# EAGLE design p8x-2016-propplug (EAGLE 7.7.0)
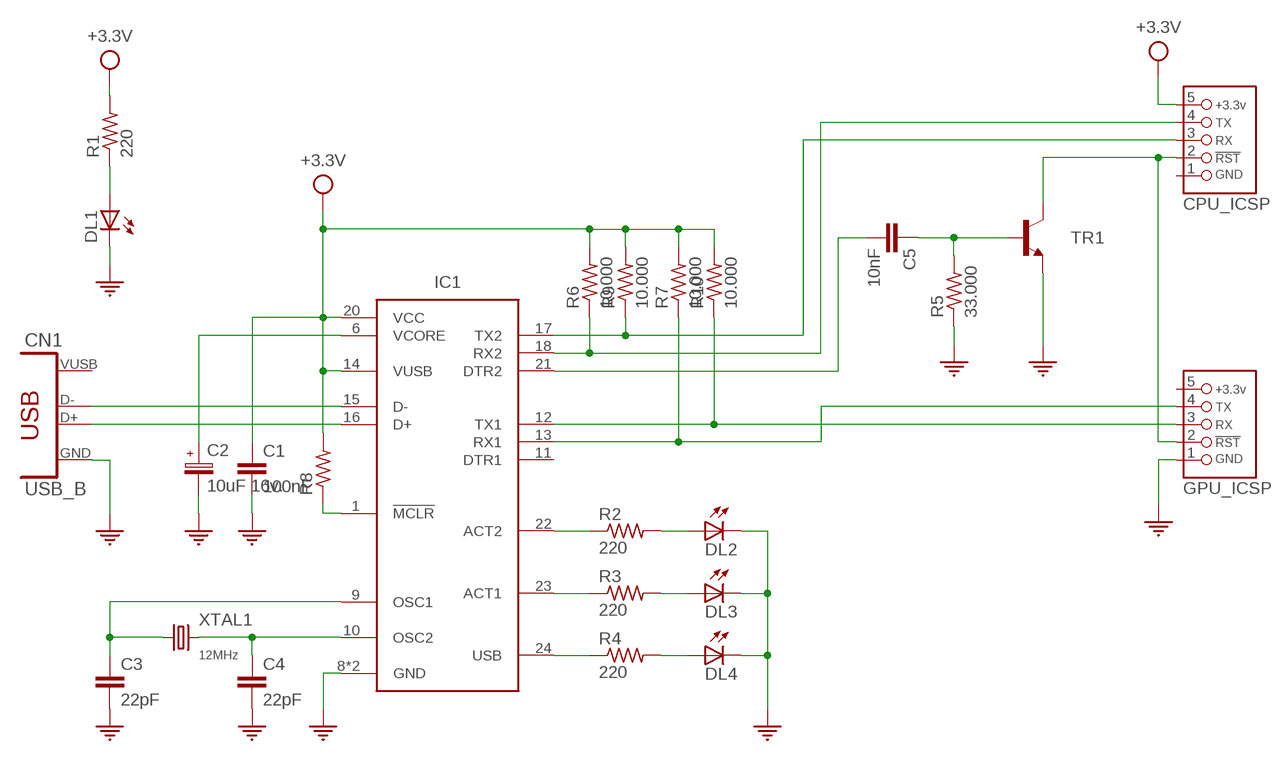
[diagram p0: schematic, sheet 1]

## Parts
C1  100nF  C  [C050-025X075]
C2  10uF 16v.  CP-2.5-6  [E2,5-6]
C3  22pF  C-DISC  [C050-025X075D]
C4  22pF  C-DISC  [C050-025X075D]
C5  10nF  C  [C050-025X075]
CN1  USB_B  [USB-B]
CPU_ICSP  PROPELLER_ICSP_HEADER  [HEADER_PRG_1X05]
DL1  LED-3MM  [LED3MM]
DL2  LED-3MM  [LED3MM]
DL3  LED-3MM  [LED3MM]
DL4  LED-3MM  [LED3MM]
GPU_ICSP  PROPELLER_ICSP_HEADER  [HEADER_PRG_1X05]
IC1  PIC18F24J50-I/P  [DIL28]
R1  220  R-1/4W  [0207/10]
R2  220  R-1/4W  [0207/10]
R3  220  R-1/4W  [0207/10]
R4  220  R-1/4W  [0207/10]
R5  33.000  R-1/4W  [0207/10]
R6  10.000  R-1/4W  [0207/10]
R7  10.000  R-1/4W  [0207/10]
R8  R-1/4W  [0207/10]
R9  10.000  R-1/4W  [0207/10]
R10  10.000  R-1/4W  [0207/10]
TR1  BC547  [TO92]
XTAL1  12MHz  CRYSTAL-HC49/S  [HC49/S]

## Nets
!RES1!: C5.2 IC1.21(DTR2)
+3.3V: C1.1 CPU_ICSP.5 IC1.14(VUSB) IC1.20(VCC) R1.2 R6.2 R7.2 R8.2 R9.2 R10.2
ACT1: IC1.23(ACT1) R3.1
ACT2: IC1.22(ACT2) R2.1
GND: C1.2 C2.- C3.2 C4.2 CN1.4(GND) DL1.K(C) DL2.K(C) DL3.K(C) DL4.K(C) GPU_ICSP.1 IC1.8(GND) IC1.19(GND) R5.1 TR1.1(E)
N$1: IC1.1(!MCLR!) R8.1
N$2: CN1.2(D-) IC1.15(D-)
N$3: CN1.3(D+) IC1.16(D+)
N$4: C4.1 IC1.10(OSC2) XTAL1.2
N$5: C3.1 IC1.9(OSC1) XTAL1.1
N$6: C5.1 R5.2 TR1.2(B)
N$7: DL2.A R2.2
N$8: DL3.A R3.2
N$9: C2.+ IC1.6(VCORE)
N$10: DL4.A R4.2
N$11: DL1.A R1.1
N$13: CPU_ICSP.2 GPU_ICSP.2 TR1.3(C)
RX1: CPU_ICSP.4 IC1.18(RX2) R6.1
RX2: GPU_ICSP.4 IC1.13(RX1) R7.1
TX1: CPU_ICSP.3 IC1.17(TX2) R9.1
TX2: GPU_ICSP.3 IC1.12(TX1) R10.1
USB: IC1.24(USB) R4.1
Unconnected: IC1.11(DTR1)

## Power pins joined to a net without a drawn wire
1: CPU_ICSP.1
5: GPU_ICSP.5
VUSB: CN1.1(VUSB)

## Library data of the parts
C1 C3-C5 = p8x-2016:C: Capacitor
C2 = p8x-2016:CP: Polarized Capacitor
CN1 = propdev-2016:USB_B: MINI USB 4 Pol.
CPU_ICSP GPU_ICSP = p8x-2016:PROPELLER_ICSP_HEADER
DL1-DL4 = p8x-2016:LED: LED
IC1 = dual-propplug:PIC18F24J50
R1-R10 = p8x-2016:R: Resistor
TR1 = propdev-2016:BC547*: NPN Transistor
XTAL1 = propdev-2016:CRYSTAL

## Board
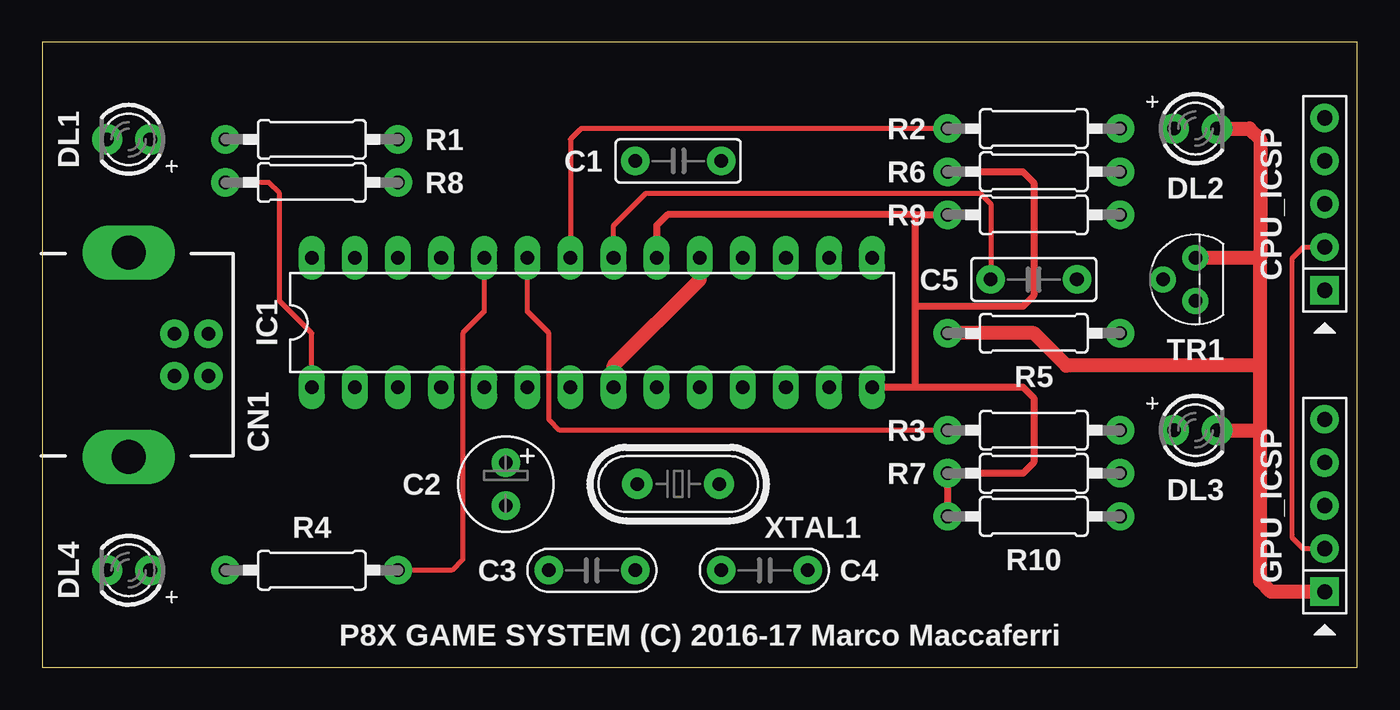
[diagram p1: board, top side]
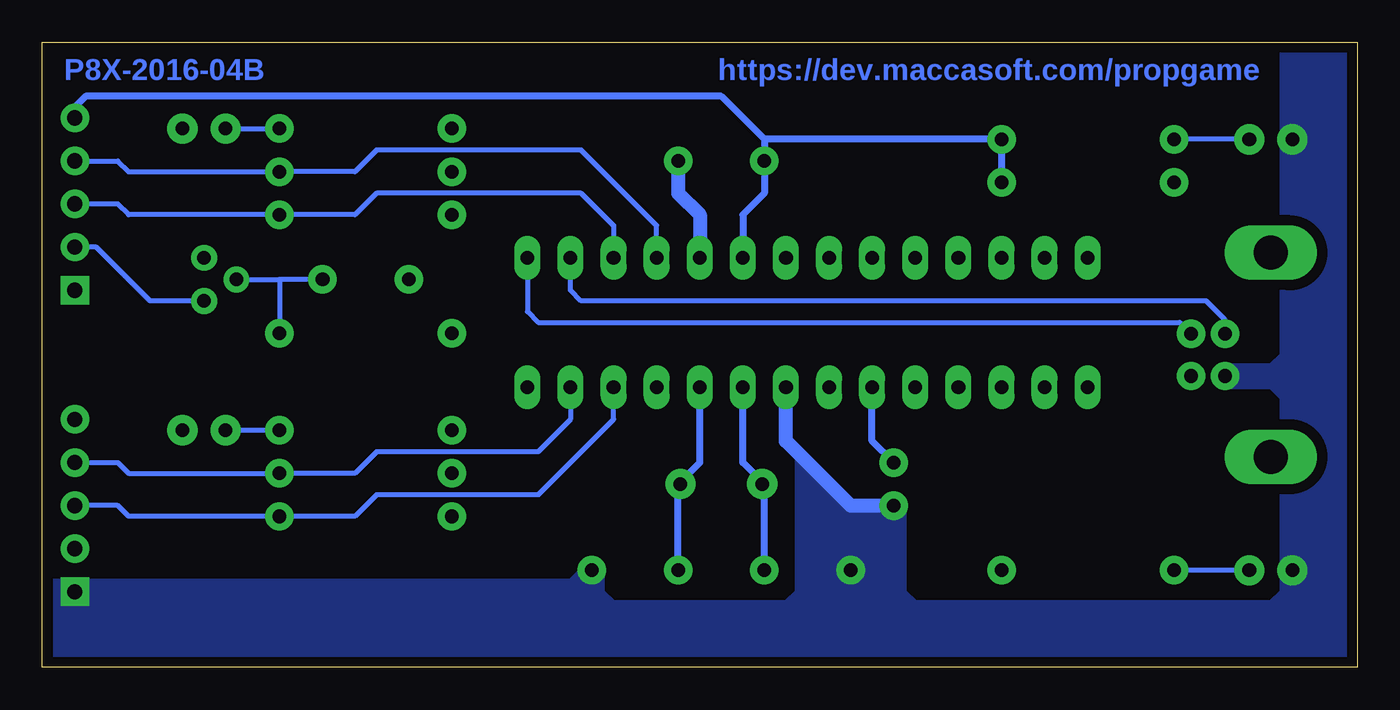
[diagram p2: board, bottom side, seen from below]

Size 77.47 x 36.83 mm. Coordinates in mm from the lower left corner, seen from the top.
Outline: 0,0 77.47,0 77.47,36.83 0,36.83 0,0
Copper layers (1*16): Top 0.035mm / dielectric 1.5mm / Bottom 0.035mm
Design rules "md *": minimum track width 6mil, minimum drill 8mil, track to track 8mil, track to pad 8mil, pad to pad 8mil, via to via 8mil, smd to smd 8mil, copper to edge 20mil, drill to drill 8mil, minimum pad ring 8mil, minimum via ring 8mil, stop-mask expansion 8mil, vias tented up to drill 0mil, thermal gap 10mil

### Footprints (pad centres in the part's own frame; a part is rotated, then mirrored left to right if it is on the bottom)
C050-025X075 = drill 0.8 pad 1.676: 1 -2.54,0; 2 2.54,0
E2,5-6 = drill 0.8 pad 1.676: + -1.27,0; - 1.27,0
C050-025X075D = drill 0.8 pad 1.676: 1 -2.54,0; 2 2.54,0
USB-B = drill 0.8 pad 1.676: 1 4.71,-1.25; 2 4.71,1.25; 3 2.71,1.25; 4 2.71,-1.25 | drill 2 pad 3.2 long: M1 0,6.02; M2 0,-6.02
HEADER_PRG_1X05 = drill 0.9 pad 1.676 square: 1 -5.08,0 | drill 0.9 pad 1.676: 2 -2.54,0; 3 0,0; 4 2.54,0; 5 5.08,0
LED3MM = drill 0.8 pad 1.778: A -1.27,0; K 1.27,0
DIL28 = drill 0.8 pad 1.524 long: 1 -16.51,-3.81; 2 -13.97,-3.81; 3 -11.43,-3.81; 4 -8.89,-3.81; 5 -6.35,-3.81; 6 -3.81,-3.81; 7 -1.27,-3.81; 8 1.27,-3.81; 9 3.81,-3.81; 10 6.35,-3.81; 11 8.89,-3.81; 12 11.43,-3.81; 13 13.97,-3.81; 14 16.51,-3.81; 15 16.51,3.81; 16 13.97,3.81; 17 11.43,3.81; 18 8.89,3.81; 19 6.35,3.81; 20 3.81,3.81; 21 1.27,3.81; 22 -1.27,3.81; 23 -3.81,3.81; 24 -6.35,3.81; 25 -8.89,3.81; 26 -11.43,3.81; 27 -13.97,3.81; 28 -16.51,3.81
0207/10 = drill 0.8 pad 1.676: 1 -5.08,0; 2 5.08,0
TO92 = drill 0.8 pad 1.524: 1 1.27,0; 2 0,1.905; 3 -1.27,0
HC49/S = drill 0.8 pad 1.778: 1 -2.413,0; 2 2.413,0

### Placement (x,y rotation side)
C1  37.47,29.84 0 top
C2  27.3,10.79 270 top
C3  32.38,5.71 180 top
C4  42.55,5.71 0 top
C5  58.42,22.86 180 top
CN1  5.08,18.41 0 top
CPU_ICSP  75.56,27.3 90 top
DL1  5.08,31.11 180 top
DL2  67.94,31.75 0 top
DL3  67.94,13.97 0 top
DL4  5.08,5.71 180 top
GPU_ICSP  75.56,9.53 90 top
IC1  32.38,20.32 0 top
R1  15.88,31.11 0 top
R2  58.42,31.75 0 top
R3  58.42,13.97 0 top
R4  15.88,5.71 180 top
R5  58.42,19.68 0 top
R6  58.42,29.21 180 top
R7  58.42,11.43 180 top
R8  15.88,28.57 0 top
R9  58.42,26.67 180 top
R10  58.42,8.89 180 top
TR1  67.94,22.86 90 top
XTAL1  37.47,10.79 0 top

### Tracks (layer width: path | path; a pad name or v marks a point on that pad's centre or on a via)
!RES1!
  Top 0.305: IC1.21 33.66,26.04 35.56,27.94 55.24,27.94 55.88,27.3 C5.2
+3.3V
  Top 0.406: IC1.14 51.44,16.51 | 51.44,16.51 51.44,21.27 | 51.44,21.27 51.44,26.67 | 51.44,26.67 36.83,26.67 36.2,26.04 IC1.20 | 51.44,16.51 57.78,16.51 58.42,15.88 58.42,12.06 57.78,11.43 R7.2 R10.2 | R6.2 57.78,29.21 58.42,28.57 58.42,21.91 57.78,21.27 51.44,21.27 | 51.44,26.67 R9.2
  Bottom 0.406: CPU_ICSP.5 75.56,33.02 74.93,33.66 37.47,33.66 34.92,31.11 | IC1.20 36.2,26.67 34.92,27.94 C1.1 34.92,31.11 | 34.92,31.11 R1.2 R8.2
ACT1
  Top 0.305: R3.1 30.48,13.97 29.84,14.61 29.84,19.68 28.57,20.95 IC1.23
ACT2
  Top 0.305: R2.1 31.75,31.75 31.11,31.11 IC1.22
GND
  Top 0.813: DL2.K 71.12,31.75 71.75,31.11 71.75,24.13 | 71.75,24.13 TR1.1 | DL3.K 71.75,13.97 | 71.75,13.97 71.75,17.78 | 71.75,17.78 71.75,24.13 | GPU_ICSP.1 72.39,4.45 71.75,5.08 71.75,13.97 | IC1.8 33.66,17.78 38.73,22.86 IC1.19 | 71.75,17.78 60.33,17.78 58.42,19.68 R5.1
  Bottom 0.813: C1.2 40.01,27.94 38.73,26.67 IC1.19 | IC1.8 33.66,13.34 29.84,9.53 C2.-
  pour Bottom (isolate 0.61, no thermals): 0,0 0,36.83 4.45,36.83 4.45,18.41 5.08,17.78 7.62,17.78 7.62,16.51 5.08,16.51 4.45,15.88 4.45,4.45 5.08,3.81 26.04,3.81 26.67,4.45 26.67,9.53 29.84,9.53 33.02,12.7 33.02,4.45 33.66,3.81 43.81,3.81 44.45,4.45 44.45,5.71 45.72,5.71 46.35,5.08 76.83,5.08 76.83,0
N$1
  Top 0.305: IC1.1 15.88,19.68 13.97,21.59 13.97,27.94 13.34,28.57 R8.1
N$2
  Bottom 0.305: IC1.15 48.9,20.95 48.26,20.32 10.45,20.32 CN1.2
N$3
  Bottom 0.305: CN1.3 7.79,20.49 8.89,21.59 45.72,21.59 46.35,22.23 IC1.16
N$4
  Bottom 0.406: IC1.10 38.73,12.06 39.88,10.92 XTAL1.2 40.01,10.67 C4.1
N$5
  Bottom 0.406: IC1.9 36.2,12.06 35.05,10.92 XTAL1.1 34.92,10.67 C3.1
N$6
  Bottom 0.305: TR1.2 63.5,22.86 | 63.5,22.86 R5.2 | C5.1 63.5,22.86
N$7
  Bottom 0.305: DL2.A R2.2
N$8
  Bottom 0.305: R3.2 DL3.A
N$9
  Bottom 0.406: C2.+ 28.57,13.34 IC1.6
N$10
  Bottom 0.305: DL4.A R4.2
N$11
  Bottom 0.305: DL1.A R1.1
N$13
  Top 0.305: GPU_ICSP.2 74.3,6.99 73.66,7.62 73.66,24.13 74.3,24.77 CPU_ICSP.2
  Bottom 0.305: TR1.3 71.12,21.59 74.3,24.77 CPU_ICSP.2
RX1
  Bottom 0.305: CPU_ICSP.4 73.03,29.84 72.39,29.21 R6.1 59.05,29.21 57.78,30.48 45.72,30.48 41.27,26.04 IC1.18
RX2
  Bottom 0.305: GPU_ICSP.4 73.03,12.06 72.39,11.43 R7.1 59.05,11.43 57.78,12.7 48.26,12.7 46.35,14.61 IC1.13
TX1
  Bottom 0.305: IC1.17 43.81,26.04 45.72,27.94 57.78,27.94 59.05,26.67 R9.1 72.39,26.67 73.03,27.3 CPU_ICSP.3
TX2
  Bottom 0.305: IC1.12 43.81,14.61 48.26,10.16 57.78,10.16 59.05,8.89 R10.1 72.39,8.89 73.03,9.53 GPU_ICSP.3
USB
  Top 0.305: IC1.24 26.04,20.95 24.77,19.68 24.77,6.35 24.13,5.71 R4.1

### Text on the board
Bottom: https://dev.maccasoft.com/propgame | P8X-2016-04B
tNames: P8X GAME SYSTEM (C) 2016-17 Marco Maccaferri